# Altium schematic sheet PLL2.SchDoc
size A; SheetNumber: 5; SheetTotal: 9
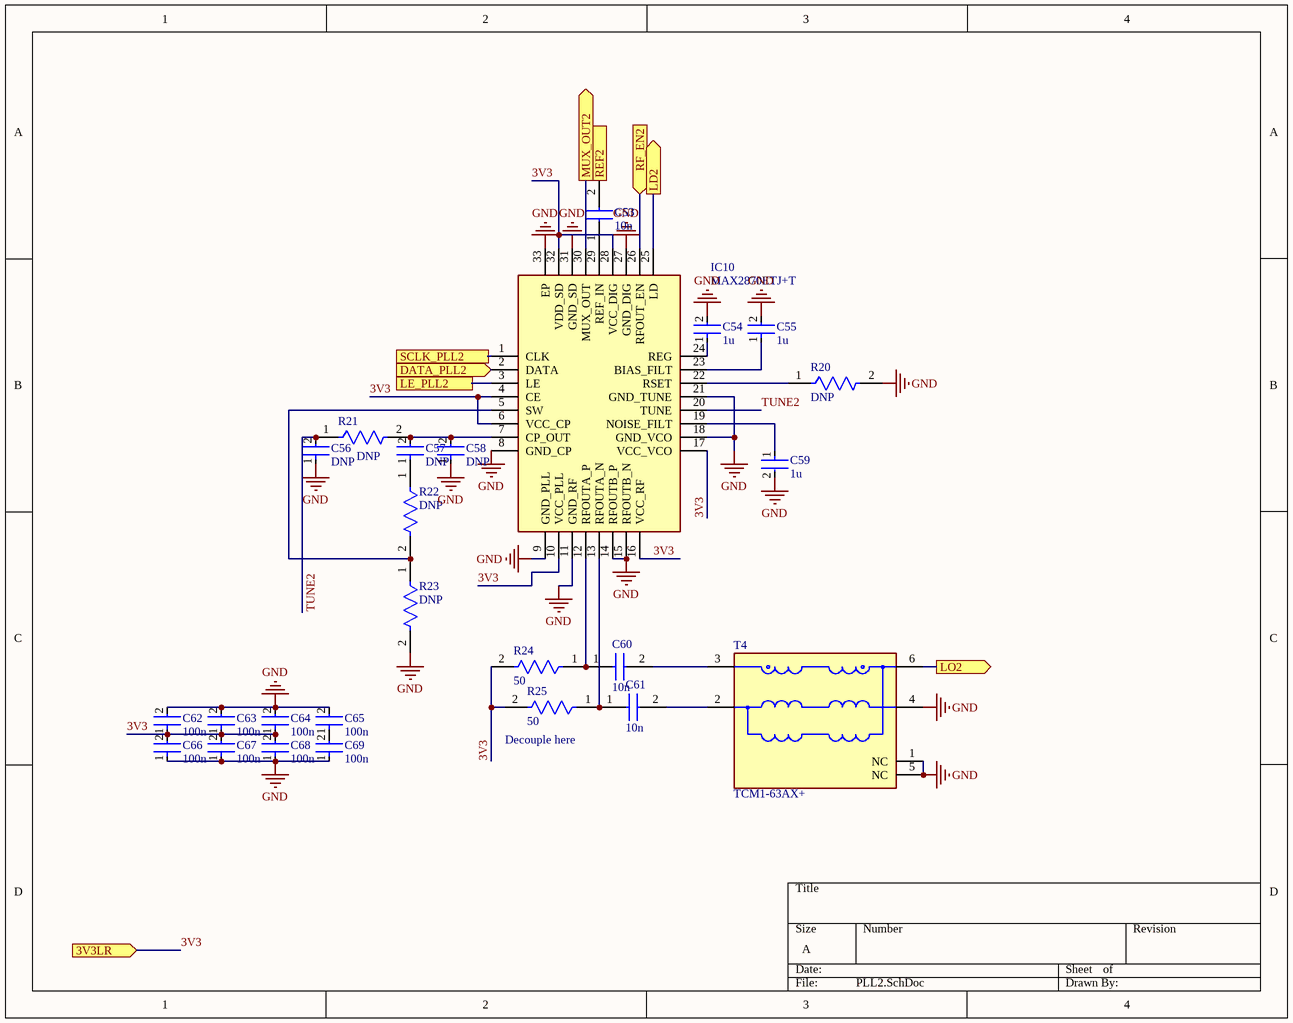
[diagram p0: PLL2.SchDoc]

## Parts
C53  10n  [CAPC1005X61N]
C54  1u  [FP-GRM155-0_1-MFG]
C55  1u  [FP-GRM155-0_1-MFG]
C56  DNP  [FP-GRM155-0_05-IPC_C]  (no BOM)
C57  DNP  [FP-GRM155-0_05-IPC_C]  (no BOM)
C58  DNP  [FP-GRM155-0_05-IPC_C]  (no BOM)
C59  1u  [FP-GRM155-0_1-MFG]
C60  10n  [CAPC1005X61N]
C61  10n  [CAPC1005X61N]
C62  100n  [FP-GRM155-0_05-IPC_C]
C63  100n  [FP-GRM155-0_05-IPC_C]
C64  100n  [FP-GRM155-0_05-IPC_C]
C65  100n  [FP-GRM155-0_05-IPC_C]
C66  100n  [FP-GRM155-0_05-IPC_C]
C67  100n  [FP-GRM155-0_05-IPC_C]
C68  100n  [FP-GRM155-0_05-IPC_C]
C69  100n  [FP-GRM155-0_05-IPC_C]
IC10  MAX2870ETJ+T  [QFN50P500X500X80-33N]
R20  DNP  [FP-AC0402-IPC_B]  (no BOM)
R21  DNP  [FP-AC0402-IPC_B]  (no BOM)
R22  DNP  [FP-AC0402-IPC_B]  (no BOM)
R23  DNP  [FP-AC0402-IPC_B]  (no BOM)
R24  50  [FP-RC0402-0_4-MFG]
R25  50  [FP-RC0402-0_4-MFG]
T4  TCM1-63AX+  [FP-TCM1-63AX+-MFG]

## Ports
3V3LR (in), DATA_PLL2 (in), LD2 (out), LE_PLL2 (in), LO2 (out), MUX_OUT2 (out), REF2 (in), RF_EN2 (in), SCLK_PLL2 (in)

## Nets
GND: C54.2 C55.2 C56.1 C58.1 C59.2 C62.2 C63.2 C64.2 C65.2 C66.1 C67.1 C68.1 C69.1 IC10.8(GND_CP) IC10.9(GND_PLL) IC10.11(GND_RF) IC10.14(RFOUTB_P) IC10.15(RFOUTB_N) IC10.18(GND_VCO) IC10.21(GND_TUNE) IC10.27(GND_DIG) IC10.31(GND_SD) IC10.33(EP) R20.2 R23.2 T4.1(NC) T4.4(SECONDARY) T4.5(NC)
3V3: C62.1 C63.1 C64.1 C66.2 C67.2 C68.2 IC10.4(CE) IC10.6(VCC_CP) IC10.10(VCC_PLL) IC10.16(VCC_RF) IC10.17(VCC_VCO) IC10.28(VCC_DIG) IC10.32(VDD_SD) R24.2 R25.2 ; port 3V3LR
DATA_PLL2: IC10.2(DATA) ; port DATA_PLL2
LD2: IC10.25(LD) ; port LD2
LE_PLL2: IC10.3(LE) ; port LE_PLL2
LO2: T4.6(SECONDARY_DOT) ; port LO2
MUX_OUT2: IC10.30(MUX_OUT) ; port MUX_OUT2
REF2: C53.2 ; port REF2
RF_EN2: IC10.26(RFOUT_EN) ; port RF_EN2
SCLK_PLL2: IC10.1(CLK) ; port SCLK_PLL2
TUNE2: C56.2 IC10.20(TUNE) R21.1
NetC53_1: C53.1 IC10.29(REF_IN)
NetC54_1: C54.1 IC10.24(REG)
NetC55_1: C55.1 IC10.23(BIAS_FILT)
NetC57_1: C57.1 R22.1
NetC57_2: C57.2 C58.2 IC10.7(CP_OUT) R21.2
NetC59_1: C59.1 IC10.19(NOISE_FILT)
NetC60_1: C60.1 IC10.12(RFOUTA_P) R24.1
NetC60_2: C60.2 T4.3(PRIMARY_DOT)
NetC61_1: C61.1 IC10.13(RFOUTA_N) R25.1
NetC61_2: C61.2 T4.2(GND)
NetC65_1: C65.1 C69.2
NetIC10_5: IC10.5(SW) R22.2 R23.1
NetIC10_22: IC10.22(RSET) R20.1

## Notes on the sheet
- (near R25) Decouple here

## Library data of the parts
C53 C60 C61 = 520L103KT16T: Capacitor; Manufacturer_Name: ATC / Kyocera AVX; Datasheet Link: https://rfs.kyocera-avx.com/userFiles/uploads/pdfs/520l.pdf; Height: 0.61mm; Manufacturer_Part_Number: 520L103KT16T; Mouser Part Number: 581-520L103KT16T; Mouser Price/Stock: https://www.mouser.co.uk/ProductDetail/ATC-KYOCERA-AVX/520L103KT16T?qs=1tb21EFCQjo0F0Wws%2FObWA%3D%3D
C54 C55 C59 = CMP-06035-041084-1: Chip Multilayer Ceramic Capacitors for General Purpose, 0402, 1.0uF, X5R, 15%, 10%, 50V
C56-C58 C62-C69 = CMP-06035-008289-1: Chip Multilayer Ceramic Capacitors for General Purpose, 0402, 0.10uF, X5R, 15%, 10%, 100V; Capacitance: 100nF; Case Code (Metric): 1005; Width: 0.5mm; Case/Package: 0402; Case Code (Imperial): 0402; Voltage Rating (DC): 100V; Package Quantity: 10000; Length: 0.039inch; Height: 0.5mm; Max Operating Temperature: 85°C; Lead Free: Lead Free; Termination: SMD/SMT; Mount: Surface Mount; Tolerance: 10%; Packaging: Tape and Reel; Voltage Rating: 100V; Thickness: 0.022inch; Dielectric: X5R; REACH SVHC: No SVHC; Min Operating Temperature: -55°C; Weight: 0.000212oz
IC10 = MAX2870ETJ+T: Integrated Circuit; Manufacturer_Name: Analog Devices; Datasheet Link: https://datasheets.maximintegrated.com/en/ds/MAX2870.pdf; Height: 0.8mm; Manufacturer_Part_Number: MAX2870ETJ+T; Mouser Part Number: 700-MAX2870ETJ+T; Mouser Price/Stock: https://www.mouser.co.uk/ProductDetail/Analog-Devices-Maxim-Integrated/MAX2870ETJ%2bT?qs=UFD7vfw3J8rIUAsp8guXHg%3D%3D; Arrow Part Number: MAX2870ETJ+T; Arrow Price/Stock: https://www.arrow.com/en/products/max2870etjt/maxim-integrated?region=nac
R20-R23 = CMP-03412-003052-2: RES 13.3kΩ ±1% 0.063W 0402; Resistance: 13.3kR; Power Rating: 62.5mW; Max Power Dissipation: 63mW; Voltage Rating: 50V; Temperature Coefficient: 100ppm/°C; Series: AC; Width: 0.5mm; Number of Terminations: 2; Features: Moisture Resistant; Packaging: Tape and Reel; Case Code (Imperial): 0402; Resistor Type: Thick Film; Case/Package: 0402; Length: 0.039inch; RoHS Compliant: Yes; Tolerance: 1%; Case Code (Metric): 1005; Height: 0.015inch; Termination: SMD/SMT; Min Operating Temperature: -55°C; Max Operating Temperature: 155°C
R24 R25 = CMP-00621-24490980-1: RC0402JR-0750RL SMD Chip Resistor, 50 Ohm, ± 5%, 63 mW, 0402 [1005 Metric], Thick Film, General Purpose; Temperature Coefficient: 100ppm/°C; Max Power Dissipation: 63mW; Resistance: 50Ω; Width: 508µm; RoHS: Compliant; Height: 406.4µm; Length: 990.6µm; Features: Moisture Resistant; Tolerance: 5%; Lead Free: Lead Free; Case/Package: 0402; NexarPartId: 24490980; Min Operating Temperature: -55°C; Composition: Thick Film; Packaging: Tape & Reel (TR); Schedule B: 8533210045, 8533210045; Number of Terminations: 2; Max Operating Temperature: 155°C
T4 = CMP-199822-000001-1: 1:1 CORE & WIRE Transformer, 10 - 6000 MHz, 50Ω; Manufacturer: Mini-Circuits; Insertion Loss: 1.16-1.8dB; Return Loss: 9.42-16.9dB; Lead Free: Yes; Device Class L3: unset; Temperature: -40°C to +85°C; Manufacturer Part Number: TCM1-63AX+; Frequency: 10-6000MHz; Device Class L2: Transformers; RoHS: TRUE; Octopart: https://octopart.com/tcm1-63ax%2B-mini-circuits-107315723; Temperature Range Low: -40°C; Category: Trans; Package: 0; ComponentLink2URL: https://www.minicircuits.com/pdfs/TCM1-63AX+.pdf; ComponentLink2Description: Datasheet; Automotive: No; Height: 4.06mm; Device Class L1: Passive Components; Temperature Range High: +85°C; Turns Ratio: 1:1